# Altium schematic sheet 2.SchDoc
size A4; SheetNumber: 2; SheetTotal: 5
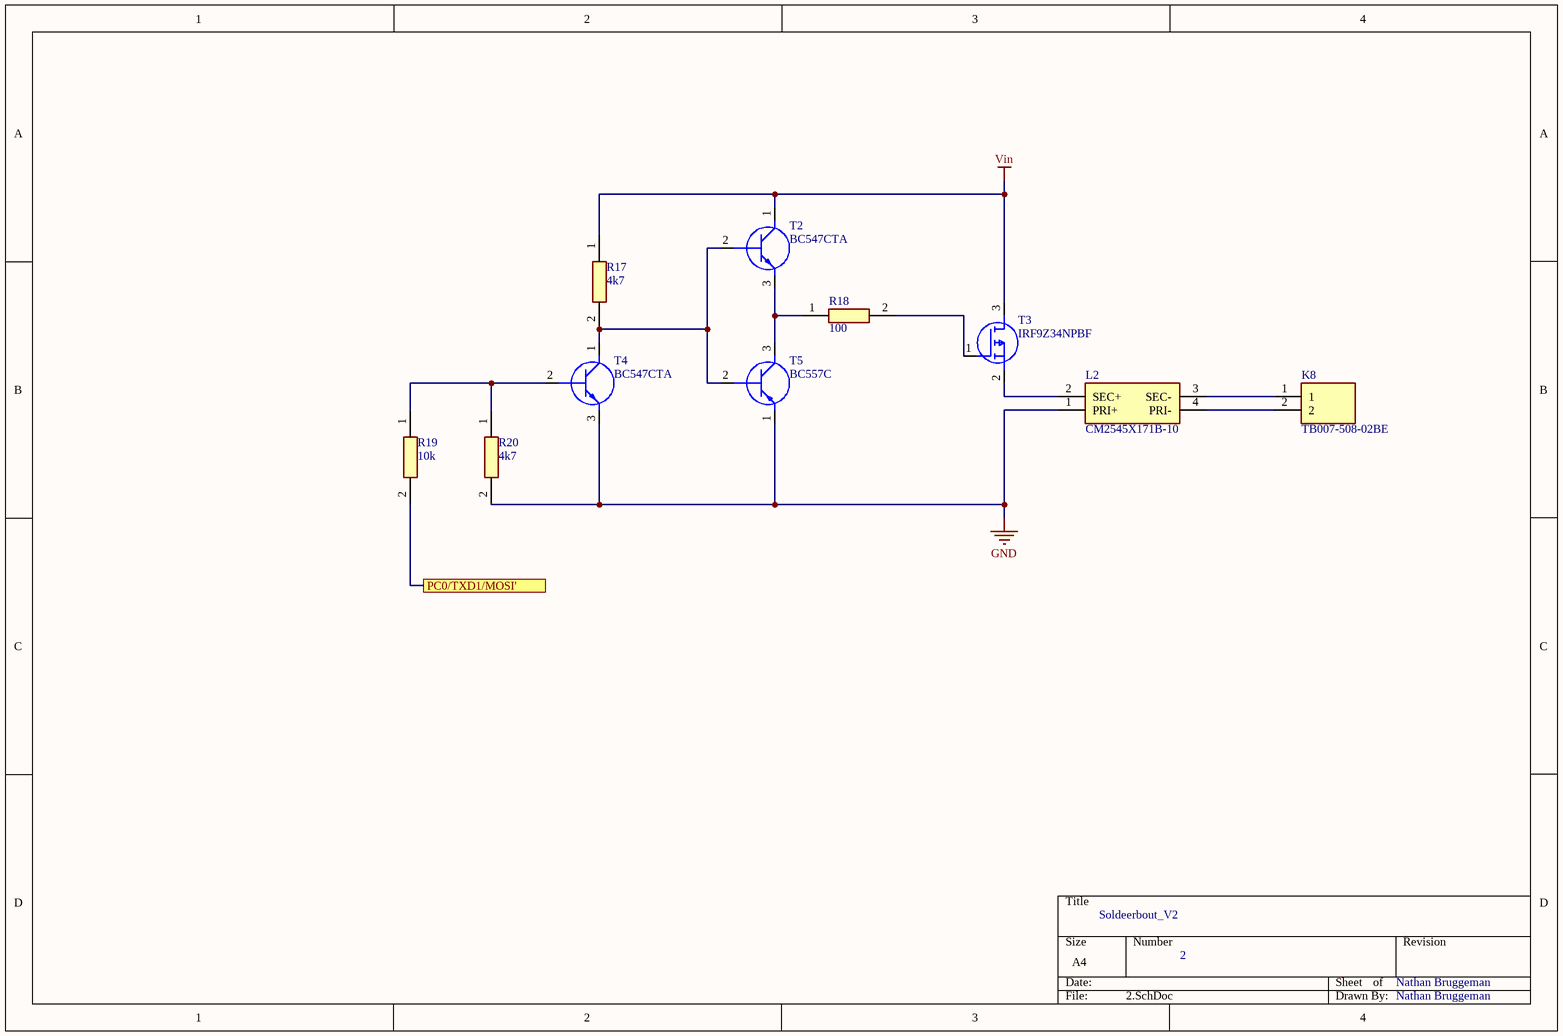
[diagram p0: 2.SchDoc]

## Parts
K8  TB007-508-02BE  [TB00750802BE]
L2  CM2545X171B-10  [CM2545X171B10]
R17  4k7  [0805]
R18  100  [0805]
R19  10k  [0805]
R20  4k7  [0805]
T2  BC547CTA  [BC557C]
T3  IRF9Z34NPBF  [TO254P469X1042X1967-3P]
T4  BC547CTA  [BC557C]
T5  BC557C  [BC557C]

## Ports
PC0/TXD1/MOSI'

## Nets
GND: L2.1(PRI+) R20.2 T4.3(E) T5.1(E)
Vin: R17.1 T2.1(C) T3.3(D)
PC0/TXD1/MOSI': R19.2 ; port PC0/TXD1/MOSI'
NetK8_1: K8.1 L2.3(SEC-)
NetK8_2: K8.2 L2.4(PRI-)
NetL2_2: L2.2(SEC+) T3.2(S)
NetR17_2: R17.2 T2.2(B) T4.1(C) T5.2(B)
NetR18_1: R18.1 T2.3(E) T5.3(C)
NetR18_2: R18.2 T3.1(G)
NetR19_1: R19.1 R20.1 T4.2(B)

## Notes on the sheet
- Soldeerbout_V2
- 2
- Nathan Bruggeman

## Library data of the parts
K8 = TB007-508-02BE: Connector; Manufacturer_Name: CUI Inc.; Datasheet Link: https://componentsearchengine.com//TB007-508-02BE.pdf; Height: 14mm; Mouser2 Part Number: 490-TB007-508-02BE; Mouser2 Price/Stock: https://www.mouser.com/Search/Refine.aspx?Keyword=490-TB007-508-02BE; Manufacturer_Part_Number: TB007-508-02BE
L2 = CM2545X171B-10: Transformer; Manufacturer_Name: Laird Technologies; Datasheet Link: https://datasheet.datasheetarchive.com/originals/dk/DKDS-7/122753.pdf; Height: 9.5mm; Manufacturer_Part_Number: CM2545X171B-10
R17-R20 = CFN0805-FZ-R030ELF: Resistor; Manufacturer_Name: Bourns; Datasheet Link: https://www.bourns.com/docs/Product-Datasheets/CFN.pdf; Height: 0.9mm; Manufacturer_Part_Number: CFN0805-FZ-R030ELF
T2 T4 = BC547CTA: Transistor BJT NPN; Manufacturer_Name: ON Semiconductor; Datasheet Link: http://www.onsemi.com/pub/Collateral/BC550-D.pdf; Manufacturer_Part_Number: BC547CTA
T3 = IRF9Z34NPBF: MOSFET (P-Channel); Manufacturer_Name: Infineon; Datasheet Link: https://componentsearchengine.com//IRF9Z34NPBF.pdf; Height: 4.69mm; Mouser2 Part Number: 942-IRF9Z34NPBF; Mouser2 Price/Stock: https://www.mouser.com/Search/Refine.aspx?Keyword=942-IRF9Z34NPBF; Manufacturer_Part_Number: IRF9Z34NPBF
T5 = BC557C: Transistor BJT PNP; Manufacturer_Name: NXP; Height: 5.2mm; Manufacturer_Part_Number: BC557C